# EAGLE design board2 (EAGLE 7.5.0)
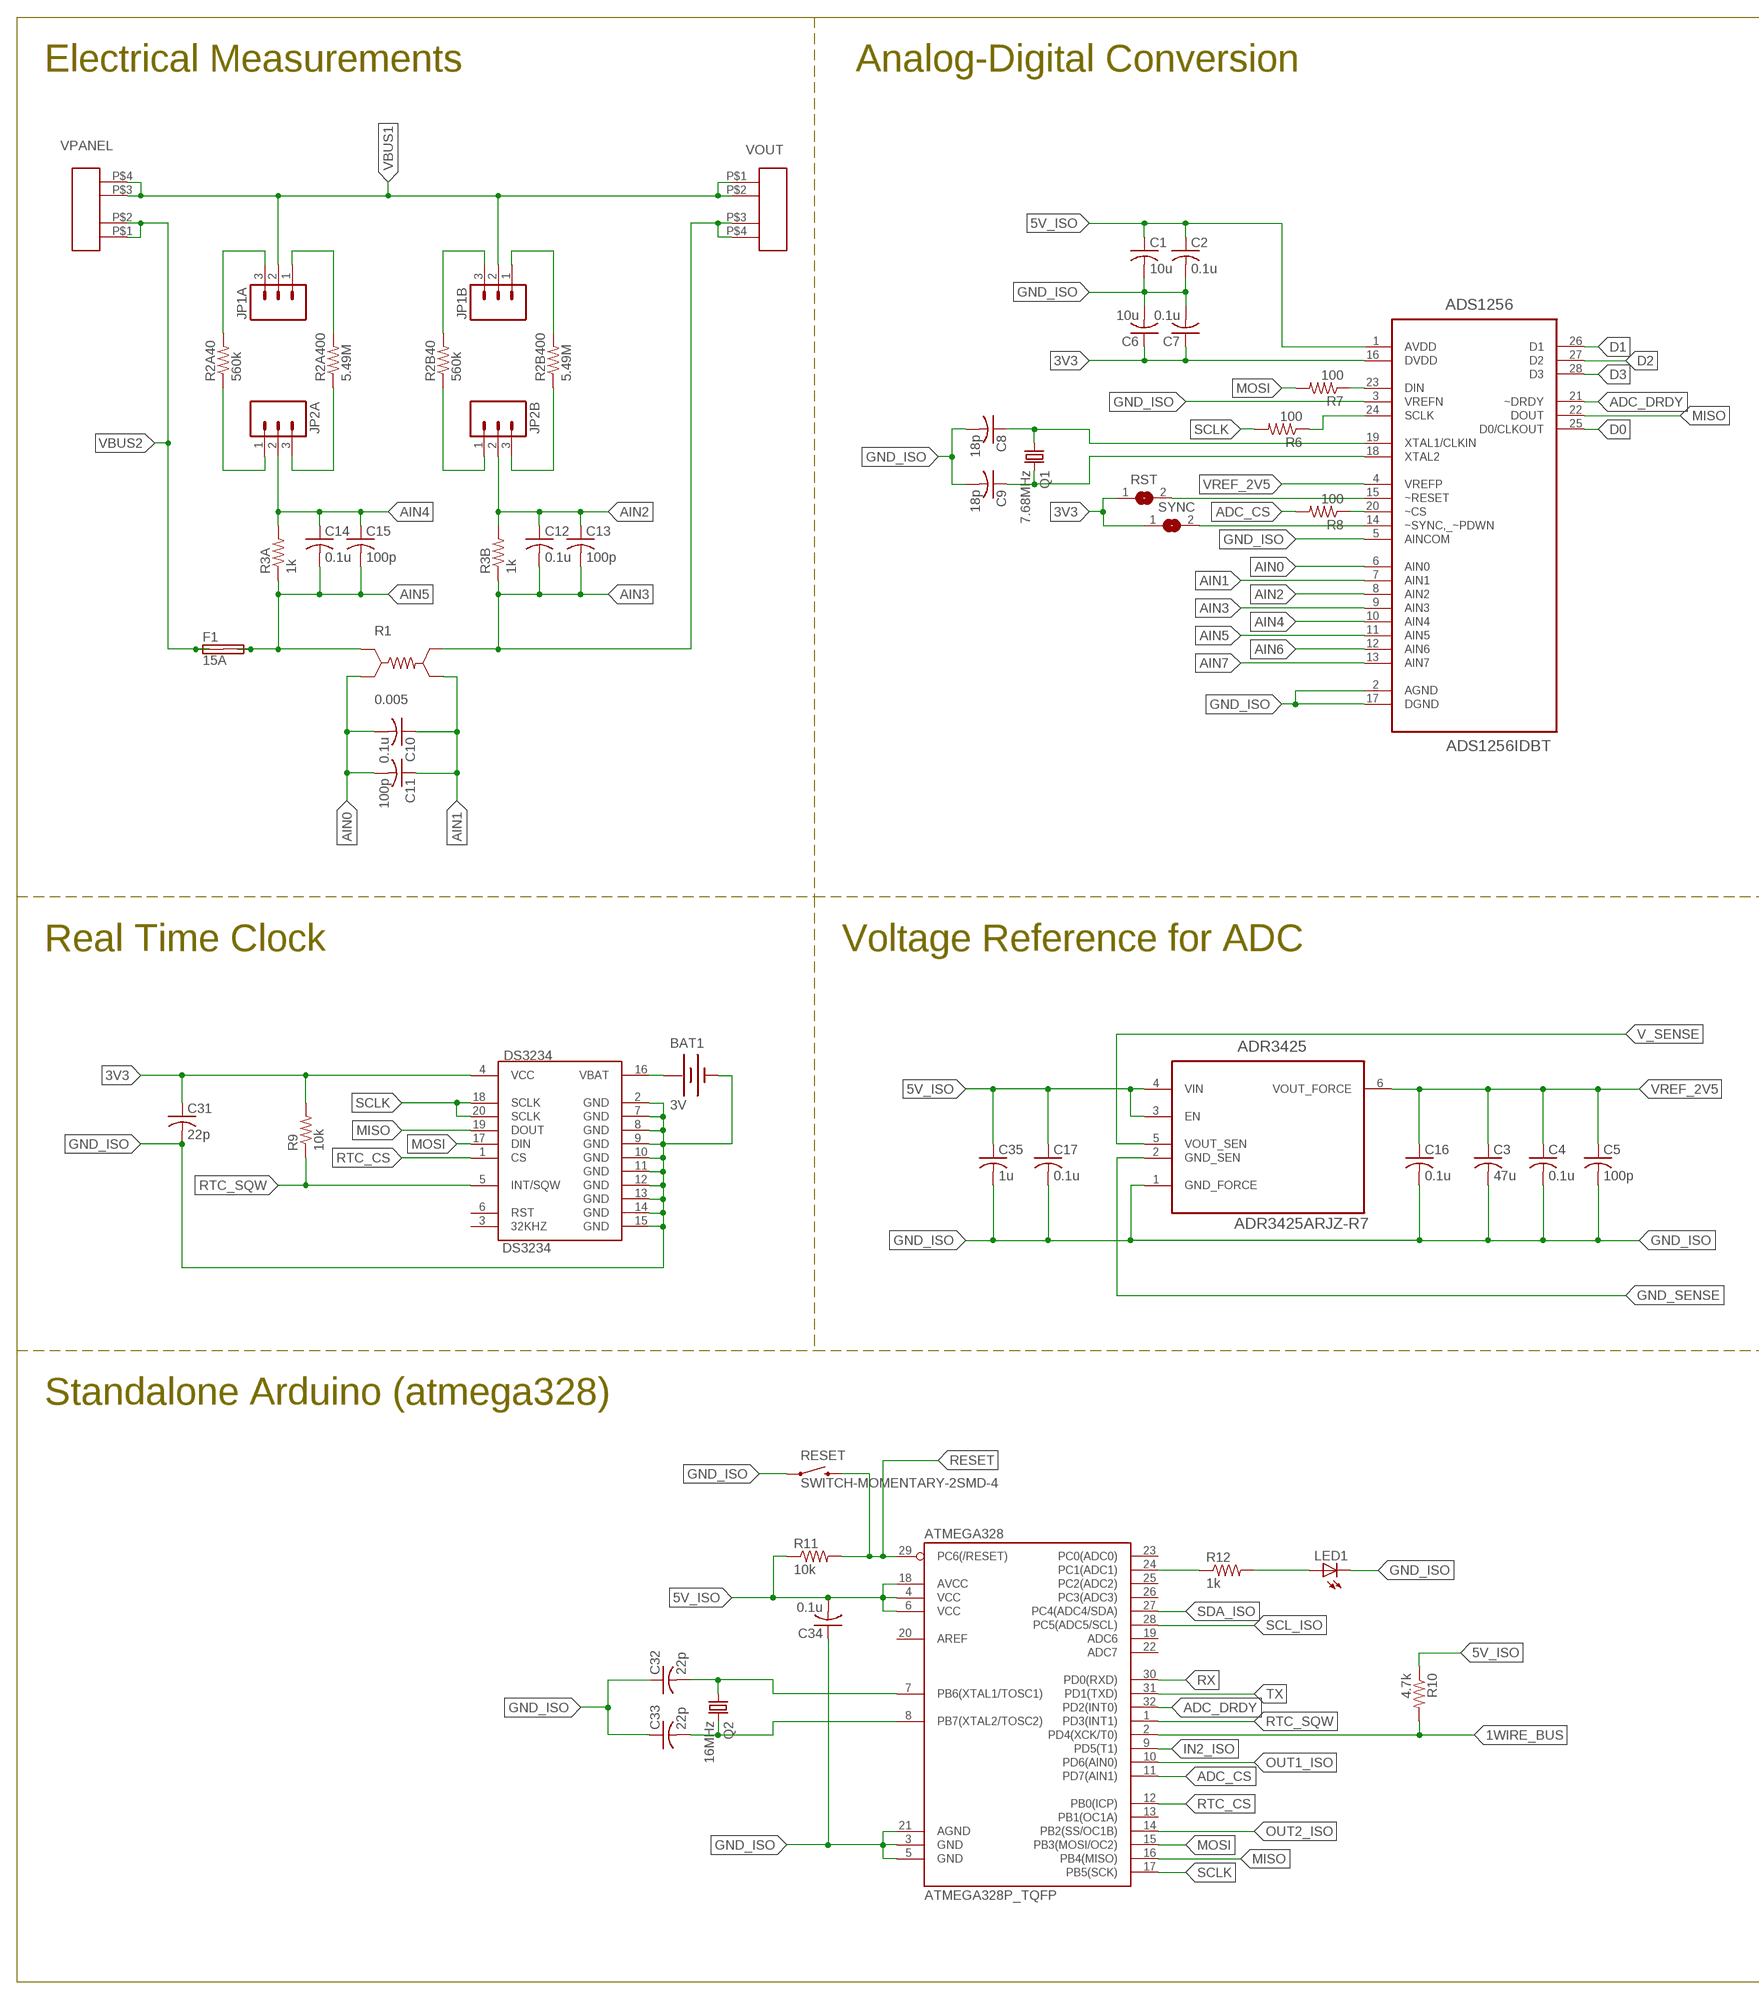
[diagram p0: schematic, sheet 1, part 1 of 2]
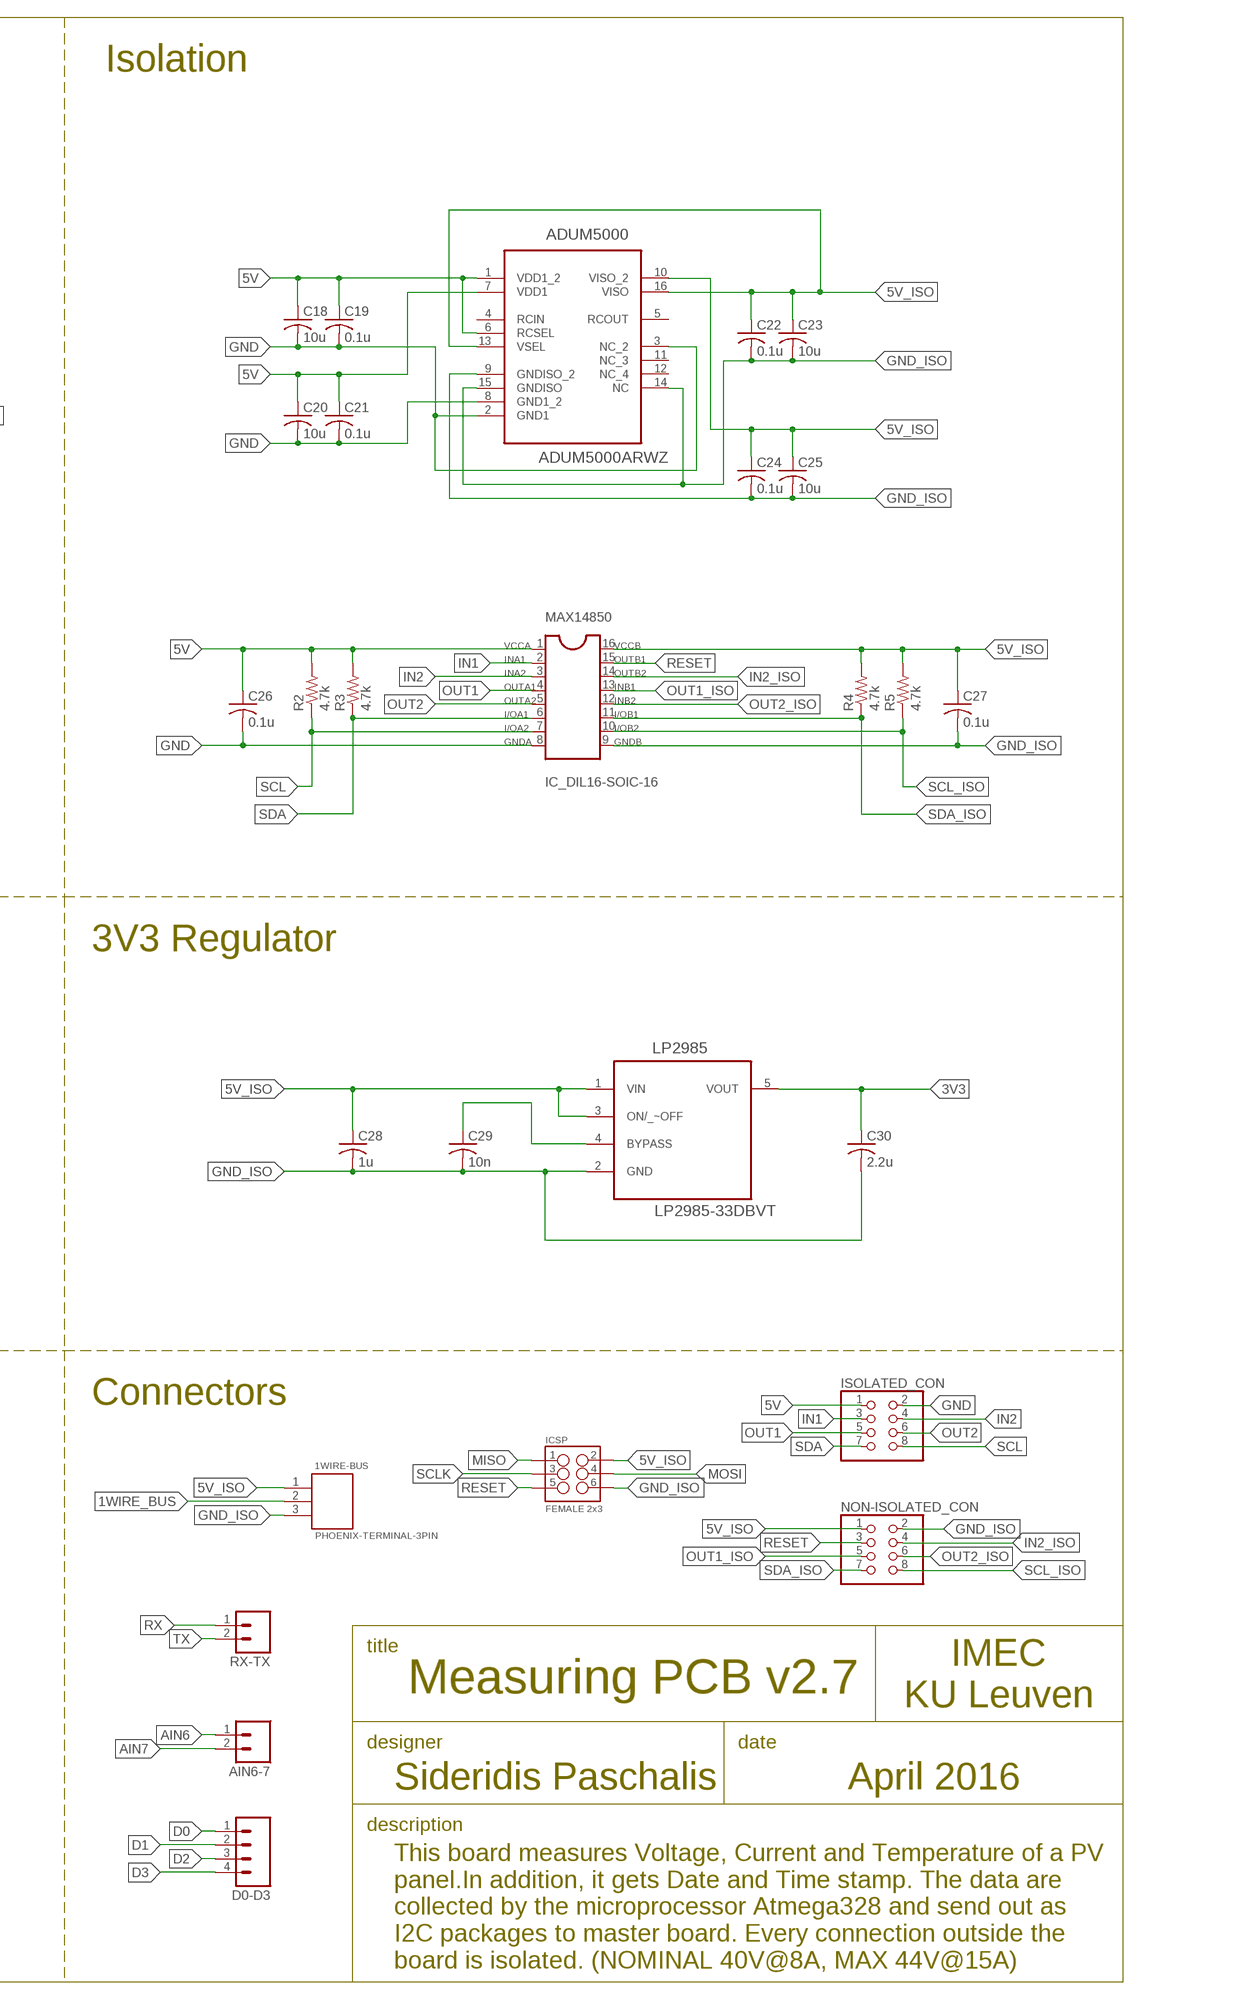
[diagram p1: schematic, sheet 1, part 2 of 2]

## Parts
1WIRE-BUS  PHOENIX-TERMINAL-3PIN  [PHOENIX-TERMINAL-3PIN]
ADR3425  ADR3425ARJZ-R7  [SOT95P280X145-6N]
ADS1256  ADS1256IDBT  [SOP65P780X200-28N]
ADUM5000  ADUM5000ARWZ  [SOIC127P1032X265-16N]
AIN6-7  M021X02_NO_SILK  [1X02_NO_SILK]
ATMEGA328  ATMEGA328P_TQFP  [TQFP32-08]
BAT1  3V  BATTERY12MM  [BATTCON_12MM]
C1  10u  C-USC3216  [C3216]
C2  0.1u  C-USC3216  [C3216]
C3  47u  C-USC3216  [C3216]
C4  0.1u  C-USC3216  [C3216]
C5  100p  C-USC3216  [C3216]
C6  10u  C-USC3216  [C3216]
C7  0.1u  C-USC3216  [C3216]
C8  18p  C-USC3216  [C3216]
C9  18p  C-USC3216  [C3216]
C10  0.1u  C-USC3216  [C3216]
C11  100p  C-USC3216  [C3216]
C12  0.1u  C-USC3216  [C3216]
C13  100p  C-USC3216  [C3216]
C14  0.1u  C-USC3216  [C3216]
C15  100p  C-USC3216  [C3216]
C16  0.1u  C-USC3216  [C3216]
C17  0.1u  C-USC3216  [C3216]
C18  10u  C-USC3216  [C3216]
C19  0.1u  C-USC3216  [C3216]
C20  10u  C-USC3216  [C3216]
C21  0.1u  C-USC3216  [C3216]
C22  0.1u  C-USC3216  [C3216]
C23  10u  C-USC3216  [C3216]
C24  0.1u  C-USC3216  [C3216]
C25  10u  C-USC3216  [C3216]
C26  0.1u  C-USC3216  [C3216]
C27  0.1u  C-USC3216  [C3216]
C28  1u  C-USC3216  [C3216]
C29  10n  C-USC3216  [C3216]
C30  2.2u  C-USC3216  [C3216]
C31  22p  C-USC3216  [C3216]
C32  22p  C-USC3216  [C3216]
C33  22p  C-USC3216  [C3216]
C34  0.1u  C-USC3216  [C3216]
C35  1u  C-USC3216  [C3216]
D0-D3  M04NO_SILK_ALL_ROUND  [1X04_NO_SILK_ALL_ROUND]
DS3234  DS3234  [DS3234]
F1  15A  SHK20L_PAS  [PAS_5X20]
ICSP  FEMALE 2x3  M03X2FEMALE  [2X3]
ISOLATED_CON  PINHD-2X4  [2X04]
JP1A  M03PTH  [1X03]
JP1B  M03PTH  [1X03]
JP2A  M03PTH  [1X03]
JP2B  M03PTH  [1X03]
LED1  LEDCHIPLED_0805  [CHIPLED_0805]
LP2985  LP2985-33DBVT  [SOT95P280X145-5N]
MAX14850  IC_DIL16-SOIC-16  [SOIC-16]
NON-ISOLATED_CON  PINHD-2X4  [2X04]
Q1  7.68MHz  CRYSTALHC49U-V  [HC49U-V]
Q2  16MHz  CRYSTALHC49U-V  [HC49U-V]
R1  0.005  LVK25R001  [LVK25]
R2  4.7k  R-US_R3216  [R3216]
R2A40  560k  R-US_M3216  [M3216]
R2A400  5.49M  R-US_M3216  [M3216]
R2B40  560k  R-US_M3216  [M3216]
R2B400  5.49M  R-US_M3216  [M3216]
R3  4.7k  R-US_R3216  [R3216]
R3A  1k  R-US_M3216  [M3216]
R3B  1k  R-US_M3216  [M3216]
R4  4.7k  R-US_R3216  [R3216]
R5  4.7k  R-US_R3216  [R3216]
R6  100  R-US_R3216  [R3216]
R7  100  R-US_R3216  [R3216]
R8  100  R-US_R3216  [R3216]
R9  10k  R-US_R3216  [R3216]
R10  4.7k  R-US_R3216  [R3216]
R11  10k  R-US_R3216  [R3216]
R12  1k  R-US_R3216  [R3216]
RESET  SWITCH-MOMENTARY-2SMD-4  [TACTILE_SWITCH_TALL]
RST  SJ  [SJ]
RX-TX  M02PTH  [1X02]
SYNC  SJ  [SJ]
VOUT  PAS-PHOENIXTERMINAL2PIN-10.16MM  [PAS-PHOENIXTERMINAL-2PIN-10.16MM]
VPANEL  PAS-PHOENIXTERMINAL2PIN-10.16MM  [PAS-PHOENIXTERMINAL-2PIN-10.16MM]

## Nets
1WIRE_BUS: 1WIRE-BUS.2 ATMEGA328.2(PD4(XCK/T0)) R10.2
3V3: ADS1256.16(DVDD) C6.1 C7.1 C30.1 C31.1 DS3234.4(VCC) LP2985.5(VOUT) R9.2 RST.1 SYNC.1
5V: ADUM5000.1(VDD1_2) ADUM5000.6(RCSEL) ADUM5000.7(VDD1) C18.1 C19.1 C20.1 C21.1 C26.1 ISOLATED_CON.1 MAX14850.1(VCCA) R2.2 R3.2
5V_ISO: 1WIRE-BUS.1 ADR3425.3(EN) ADR3425.4(VIN) ADS1256.1(AVDD) ADUM5000.10(VISO_2) ADUM5000.13(VSEL) ADUM5000.16(VISO) ATMEGA328.4(VCC) ATMEGA328.6(VCC) ATMEGA328.18(AVCC) C1.1 C2.1 C17.1 C22.1 C23.1 C24.1 C25.1 C27.1 C28.1 C34.2 C35.1 ICSP.2 LP2985.1(VIN) LP2985.3(ON/_~OFF) MAX14850.16(VCCB) NON-ISOLATED_CON.1 R4.2 R5.2 R10.1 R11.1
ADC_CS: ATMEGA328.11(PD7(AIN1)) R8.2
ADC_DRDY: ADS1256.21(~DRDY) ATMEGA328.32(PD2(INT0))
AIN0: ADS1256.6(AIN0) C10.2 C11.2 R1.INV
AIN1: ADS1256.7(AIN1) C10.1 C11.1 R1.OUTV
AIN2: ADS1256.8(AIN2) C12.1 C13.1 JP2B.2 R3B.2
AIN3: ADS1256.9(AIN3) C12.2 C13.2 R1.OUTI R3B.1 VOUT.P$3 VOUT.P$4
AIN4: ADS1256.10(AIN4) C14.1 C15.1 JP2A.2 R3A.2
AIN5: ADS1256.11(AIN5) C14.2 C15.2 F1.2A F1.2B R1.INI R3A.1
AIN6: ADS1256.12(AIN6) AIN6-7.1
AIN7: ADS1256.13(AIN7) AIN6-7.2
D0: ADS1256.25(D0/CLKOUT) D0-D3.1
D1: ADS1256.26(D1) D0-D3.2
D2: ADS1256.27(D2) D0-D3.3
D3: ADS1256.28(D3) D0-D3.4
GND: ADUM5000.2(GND1) ADUM5000.3(NC_2) ADUM5000.8(GND1_2) C18.2 C19.2 C20.2 C21.2 C26.2 ISOLATED_CON.2 MAX14850.8(GNDA)
GND_ISO: 1WIRE-BUS.3 ADR3425.1(GND_FORCE) ADS1256.2(AGND) ADS1256.3(VREFN) ADS1256.5(AINCOM) ADS1256.17(DGND) ADUM5000.9(GNDISO_2) ADUM5000.14(NC) ADUM5000.15(GNDISO) ATMEGA328.3(GND) ATMEGA328.5(GND) ATMEGA328.21(AGND) BAT1.GND(-) C1.2 C2.2 C3.2 C4.2 C5.2 C6.2 C7.2 C8.2 C9.2 C16.2 C17.2 C22.2 C23.2 C24.2 C25.2 C27.2 C28.2 C29.2 C30.2 C31.2 C32.1 C33.1 C34.1 C35.2 DS3234.2(GND) DS3234.7(GND) DS3234.8(GND) DS3234.9(GND) DS3234.10(GND) DS3234.11(GND) DS3234.12(GND) DS3234.13(GND) DS3234.14(GND) DS3234.15(GND) ICSP.6 LED1.C LP2985.2(GND) MAX14850.9(GNDB) NON-ISOLATED_CON.2 RESET.A2
GND_SENSE: ADR3425.2(GND_SEN)
IN1: ISOLATED_CON.3 MAX14850.2(INA1)
IN2: ISOLATED_CON.4 MAX14850.3(INA2)
IN2_ISO: ATMEGA328.9(PD5(T1)) MAX14850.14(OUTB2) NON-ISOLATED_CON.4
MISO: ADS1256.22(DOUT) ATMEGA328.16(PB4(MISO)) DS3234.19(DOUT) ICSP.1
MOSI: ATMEGA328.15(PB3(MOSI/OC2)) DS3234.17(DIN) ICSP.4 R7.2
N$1: ADS1256.24(SCLK) R6.1
N$2: JP1A.3 R2A40.2
N$3: JP1A.1 R2A400.2
N$4: JP2A.3 R2A400.1
N$5: JP2A.1 R2A40.1
N$6: ATMEGA328.8(PB7(XTAL2/TOSC2)) C33.2 Q2.2
N$7: JP1B.3 R2B40.2
N$8: JP1B.1 R2B400.2
N$9: JP2B.3 R2B400.1
N$10: JP2B.1 R2B40.1
N$11: ADS1256.19(XTAL1/CLKIN) C8.1 Q1.1
N$12: ADS1256.18(XTAL2) C9.1 Q1.2
N$13: ATMEGA328.7(PB6(XTAL1/TOSC1)) C32.2 Q2.1
N$14: ADS1256.23(DIN) R7.1
N$15: BAT1.PWR@1(+) DS3234.16(VBAT)
N$16: ADS1256.20(~CS) R8.1
N$17: ADS1256.15(~RESET) RST.2
N$18: ATMEGA328.24(PC1(ADC1)) R12.1
N$19: LED1.A R12.2
N$20: ADS1256.14(~SYNC,_~PDWN) SYNC.2
N$21: C29.1 LP2985.4(BYPASS)
OUT1: ISOLATED_CON.5 MAX14850.4(OUTA1)
OUT1_ISO: ATMEGA328.10(PD6(AIN0)) MAX14850.13(INB1) NON-ISOLATED_CON.5
OUT2: ISOLATED_CON.6 MAX14850.5(OUTA2)
OUT2_ISO: ATMEGA328.14(PB2(SS/OC1B)) MAX14850.12(INB2) NON-ISOLATED_CON.6
RESET: ATMEGA328.29(PC6(/RESET)) ICSP.5 MAX14850.15(OUTB1) NON-ISOLATED_CON.3 R11.2 RESET.B2
RTC_CS: ATMEGA328.12(PB0(ICP)) DS3234.1(CS)
RTC_SQW: ATMEGA328.1(PD3(INT1)) DS3234.5(INT/SQW) R9.1
RX: ATMEGA328.30(PD0(RXD)) RX-TX.1
SCL: ISOLATED_CON.8 MAX14850.7(I/OA2) R2.1
SCL_ISO: ATMEGA328.28(PC5(ADC5/SCL)) MAX14850.10(I/OB2) NON-ISOLATED_CON.8 R5.1
SCLK: ATMEGA328.17(PB5(SCK)) DS3234.18(SCLK) DS3234.20(SCLK) ICSP.3 R6.2
SDA: ISOLATED_CON.7 MAX14850.6(I/OA1) R3.1
SDA_ISO: ATMEGA328.27(PC4(ADC4/SDA)) MAX14850.11(I/OB1) NON-ISOLATED_CON.7 R4.1
TX: ATMEGA328.31(PD1(TXD)) RX-TX.2
V_SENSE: ADR3425.5(VOUT_SEN)
VBUS1: JP1A.2 JP1B.2 VOUT.P$1 VOUT.P$2 VPANEL.P$3 VPANEL.P$4
VBUS2: F1.1A F1.1B VPANEL.P$1 VPANEL.P$2
VREF_2V5: ADR3425.6(VOUT_FORCE) ADS1256.4(VREFP) C3.1 C4.1 C5.1 C16.1
Unconnected: ADUM5000.4(RCIN) ADUM5000.5(RCOUT) ADUM5000.11(NC_3) ADUM5000.12(NC_4) ATMEGA328.13(PB1(OC1A)) ATMEGA328.19(ADC6) ATMEGA328.20(AREF) ATMEGA328.22(ADC7) ATMEGA328.23(PC0(ADC0)) ATMEGA328.25(PC2(ADC2)) ATMEGA328.26(PC3(ADC3)) DS3234.3(32KHZ) DS3234.6(RST)

## Notes on the sheet
- Electrical Measurements | Analog-Digital Conversion | Isolation
- Real Time Clock | Voltage Reference for ADC | 3V3 Regulator
- Standalone Arduino (atmega328) | Connectors
- title
- Measuring PCB v2.7
- IMEC
  KU Leuven
- designer | date
- Sideridis Paschalis | April 2016
- description
- This board measures Voltage, Current and Temperature of a PV
  panel.In addition, it gets Date and Time stamp. The data are
  collected by the microprocessor Atmega328 and send out as
  I2C packages to master board. Every connection outside the
  board is isolated. (NOMINAL 40V@8A, MAX 44V@15A)

## Library data of the parts
1WIRE-BUS = Paschalis_connectors:PHOENIX-TERMINAL-3PIN
ADR3425 = Analog Devices_By_element14_Batch_1:ADR3425ARJZ-R7: Micropower, High Accuracy Voltage References; MPN: ADR3425ARJZ-R7; OC_FARNELL: 1827384; OC_NEWARK: 67R2201; PACKAGE: SOT-23-6; SUPPLIER: Analog Devices
ADS1256 = Texas Instruments_By_element14_Batch_1:ADS1256IDBT: ADC; MPN: ADS1256IDBT; OC_FARNELL: 1470337; OC_NEWARK: 73H4119; PACKAGE: SSOP-28; SUPPLIER: TEXAS INSTRUMENTS
ADUM5000 = Analog Devices_By_element14_Batch_1:ADUM5000ARWZ: 2.5 kV, Isolated DC-to-DC Converter; MPN: ADUM5000ARWZ; OC_FARNELL: 1701256; OC_NEWARK: 19P8235; PACKAGE: SOIC-16; SUPPLIER: Analog Devices
AIN6-7 RX-TX = SparkFun-Connectors:M02: Standard 2-pin 0.1" header. Use with - straight break away headers ( PRT-00116) - right angle break away headers (PRT-00553) - swiss pins (PRT-00743) - machine pins (PRT-00117) - female headers (PRT-00115) Molex polarized connector foot print use with: PRT-08233 with associated crimp pins and housings. 2.54_SCREWTERM for use with PRT-10571. 3.5mm Screw Terminal footprints for PRT-08084 5mm Screw Terminal footprints for use with PRT-08432
ATMEGA328 = SparkFun-DigitalIC:ATMEGA328P_TQFP; PROD_ID: IC-09069
BAT1 = SparkFun-Electromechanical:BATTERY: Battery Holders Various common sizes : AA, AAA, 18650 (PRT-12895), 20mm coin cell and 12mm coin cell. 20MM_4LEGS, BATT-10373; PROD_ID: BATT-08044
C1-C35 = adafruit:C-US: CAPACITOR, American symbol
D0-D3 = SparkFun-Connectors:M04: Header 4 Standard 4-pin 0.1" header. Use with straight break away headers (SKU : PRT-00116), right angle break away headers (PRT-00553), swiss pins (PRT-00743), machine pins (PRT-00117), and female headers (PRT-00115). Molex polarized connector foot print use with SKU : PRT-08231 with associated crimp pins and housings. 1MM SMD Version SKU: PRT-10208
DS3234 = SparkFun-FreqCtrl:DS3234: SPI RTC module with battery backup and internal clock.
F1 = fuse:SHK20L_PAS: FUSE HOLDER 5 x 20 mm, SH contact, SHH1 Schukat, E1073 Buerklin
ICSP = SparkFun-Connectors:M03X2: 2x3 .1" header. Shrouded, with keying- CONN-10681 SMT- CONN-11415 Pogo pins- HW-11044; PROD_ID: CONN-11566
ISOLATED_CON NON-ISOLATED_CON = adafruit:PINHD-2X4: PIN HEADER
JP1A JP1B JP2A JP2B = SparkFun-Connectors:M03: Header 3 Standard 3-pin 0.1" header. Use with straight break away headers (SKU : PRT-00116), right angle break away headers (PRT-00553), swiss pins (PRT-00743), machine pins (PRT-00117), and female headers (PRT-00115). Molex polarized connector foot print use with SKU : PRT-08232 with associated crimp pins and housings.
LED1 = adafruit:LED: LED OSRAM: - CHIPLED LG R971, LG N971, LY N971, LG Q971, LY Q971, LO R971, LY R971 LH N974, LH R974 LS Q976, LO Q976, LY Q976 LO Q996 - Hyper CHIPLED LW Q18S LB Q993, LB Q99A, LB R99A - SideLED LS A670, LO A670, LY A670, LG A670, LP A670 LB A673, LV A673, LT A673, LW A673 LH A674 LY A675 LS A676, LA A676, LO A676, LY A676, LW A676 LS A679, LY A679, LG A679 - Hyper Micro SIDELED® LS Y876, LA Y876, LO Y876, LY Y876 LT Y87S - SmartLED LW L88C, LW L88S LB L89C, LB L89S, LG L890 LS L89K, LO L89K, LY L89K LS L896, LA L896, LO L896, LY L896 - TOPLED LS T670, LO T670, LY T670, LG T670, LP T670 LSG T670, LSP T670, LSY T670, LOP T670, LYG T670 LG T671, LOG T671, LSG T671 LB T673, LV T673, LT T673, LW T673 LH T674 LS T676, LA T676, LO T676, LY T676, LB T676, LH T676, LSB T676, LW T676 LB T67C, LV T67C, LT T67C, LS T67K, LO T67K, LY T67K, LW E67C LS E67B, LA E67B, LO E67B, LY E67B, LB E67C, LV E67C, LT E67C LW T67C LS T679, LY T679, LG T679 LS T770, LO T770, LY T770, LG T770, LP T770 LB T773, LV T773, LT T773, LW T773 LH T774 LS E675, LA E675, LY E675, LS T675 LS T776, LA T776, LO T776, LY T776, LB T776 LHGB T686 LT T68C, LB T68C - Hyper Mini TOPLED® LB M676 - Mini TOPLED Santana® LG M470 LS M47K, LO M47K, LY M47K Source: http://www.osram.convergy.de/
LP2985 = Texas Instruments_By_element14_Batch_1:LP2985-33DBVT: 150-mA LOW-NOISE LOW-DROPOUT REGULATOR WITH SHUTDOWN; MPN: LP2985-33DBVT; OC_FARNELL: -; OC_NEWARK: 43J9347; PACKAGE: SOT-23-5; SUPPLIER: Texas Instruments
MAX14850 = MAX14850ASE:IC_DIL16
Q1 Q2 = adafruit:CRYSTAL: CRYSTAL; OC_FARNELL: 1666969; OC_NEWARK: unknown
R1 = LVK25:LVK25
R2 R2A40 R2A400 R2B40 R2B400 R3 R3A R3B R4-R12 = adafruit:R-US_: RESISTOR, American symbol
RESET = SparkFun-Electromechanical:SWITCH-MOMENTARY-2: Various NO switches- pushbuttons, reed, etc; PROD_ID: SWCH-11966
RST SYNC = jumper:SJ: SMD solder JUMPER
VOUT VPANEL = PAS-PHOENIXTERMINAL:PAS-PHOENIXTERMINAL2PIN-10.16MM

## Board
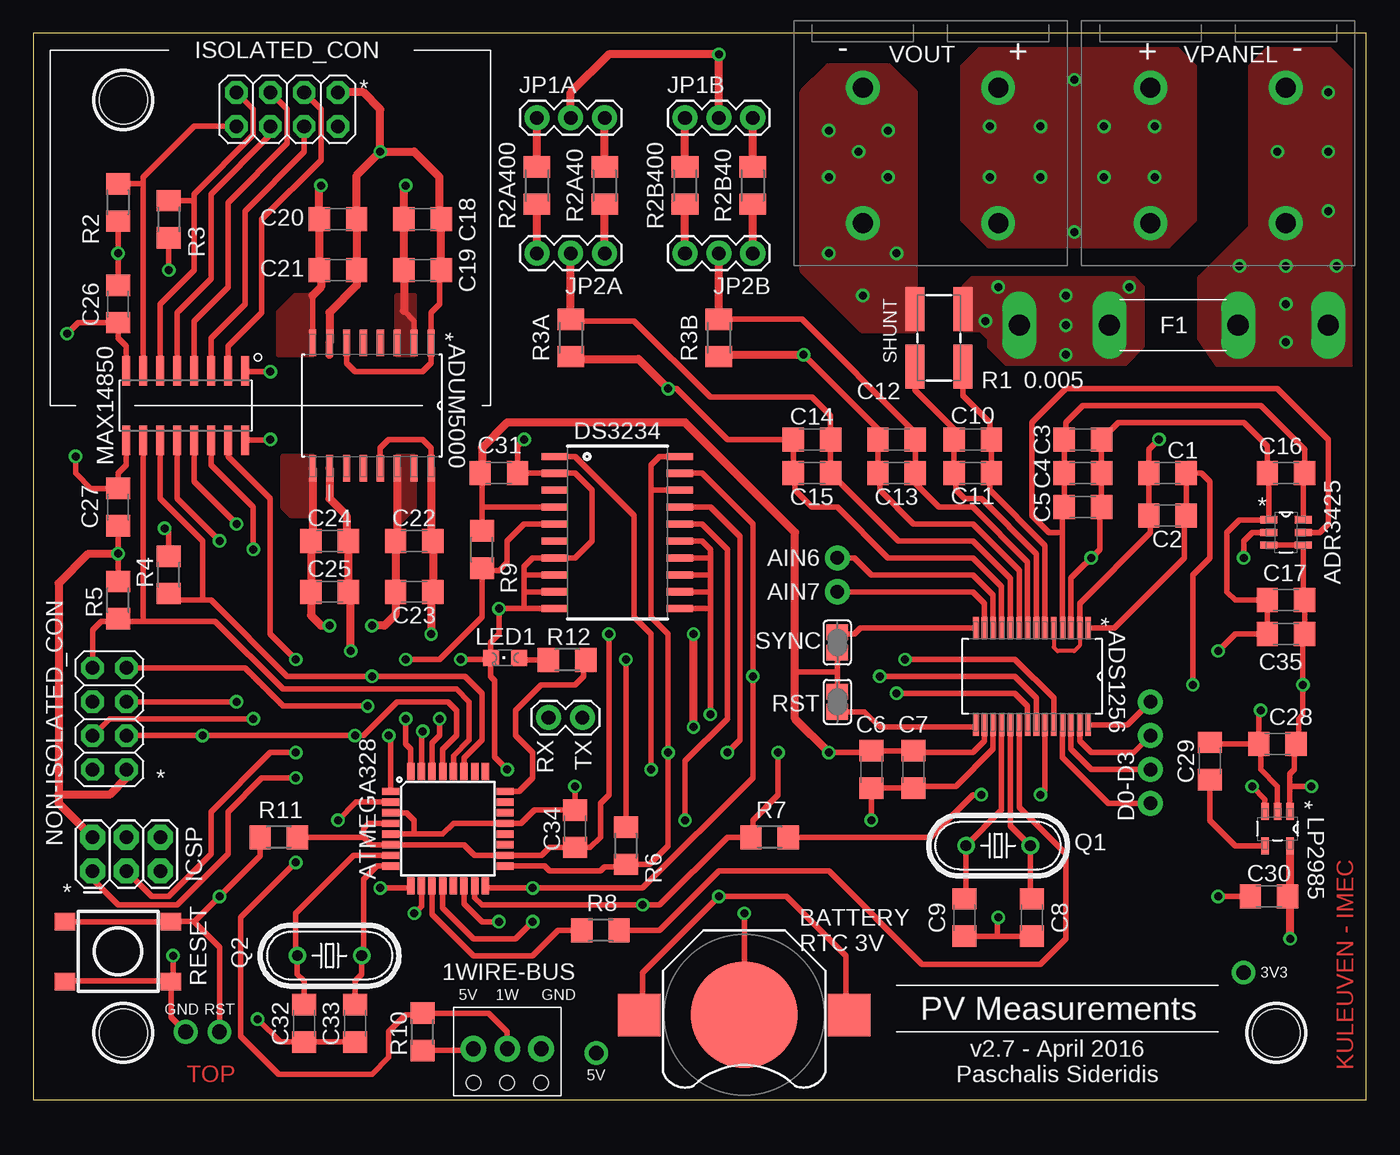
[diagram p2: board, top side]
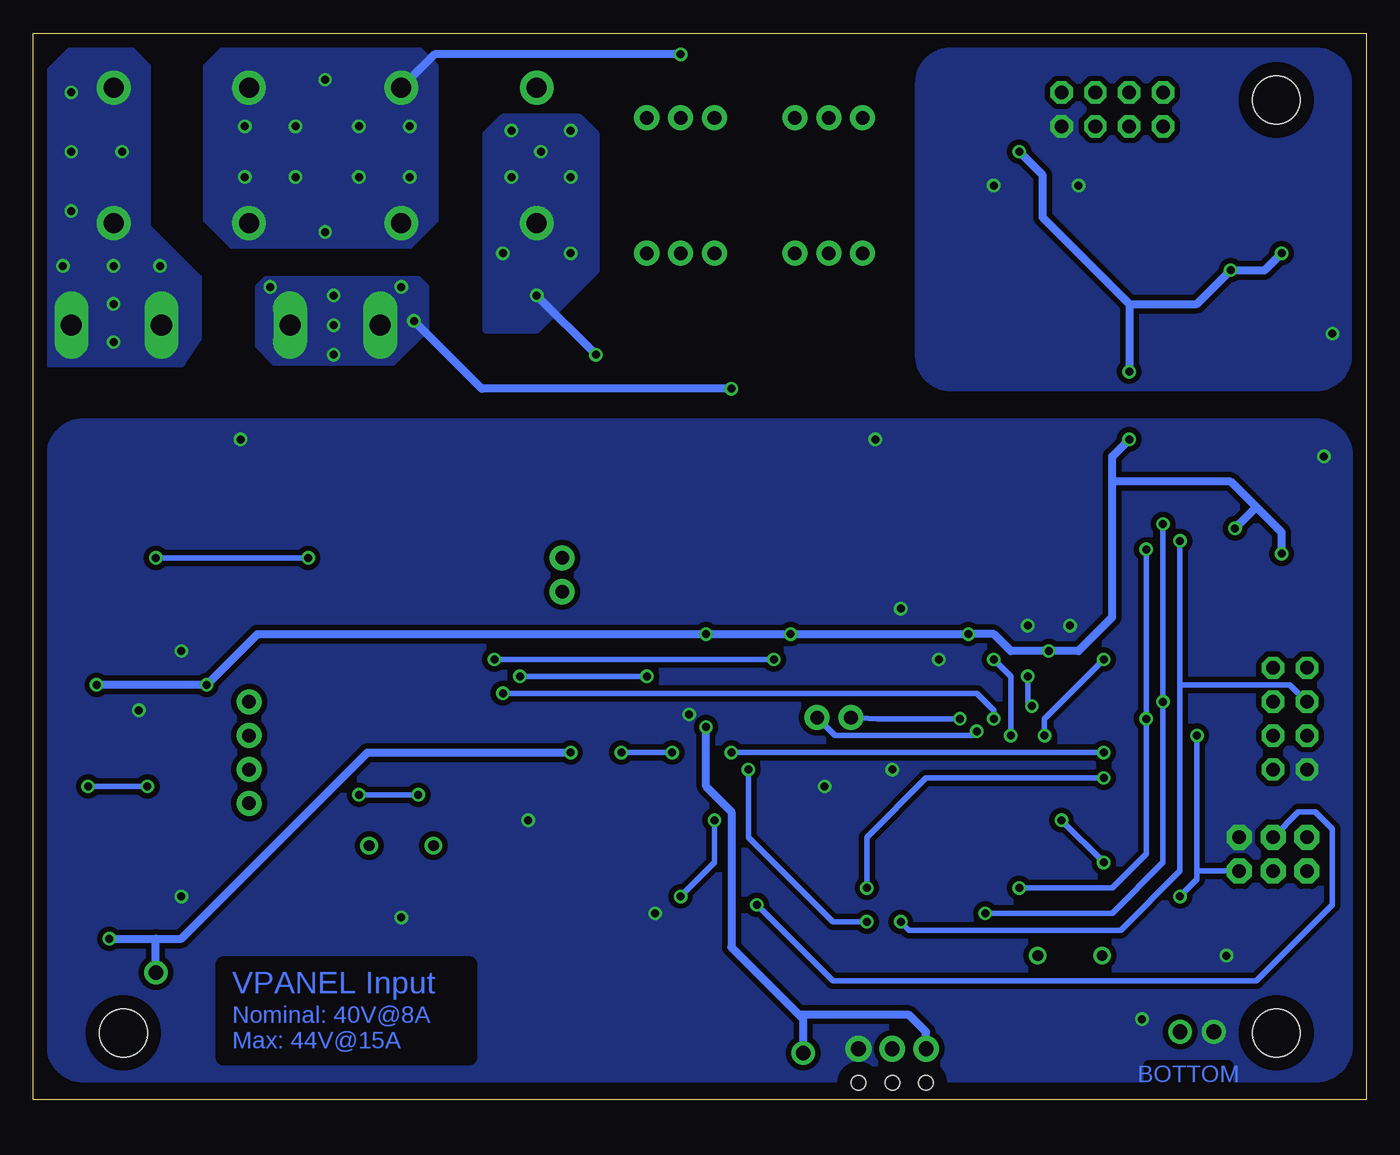
[diagram p3: board, bottom side, seen from below]

Size 100 x 80 mm. Coordinates in mm from the lower left corner, seen from the top.
Outline: 0,0 100,0 100,80 0,80 0,0
Copper layers (1*16): Top 0.035mm / dielectric 1.5mm / Bottom 0.035mm
Design rules "default": minimum track width 10mil, minimum drill 24mil, track to track 8mil, track to pad 8mil, pad to pad 8mil, via to via 8mil, smd to smd 8mil, copper to edge 40mil, drill to drill 8mil, minimum pad ring 10mil, minimum via ring 8mil, stop-mask expansion 4mil, vias tented up to drill 0mil, thermal gap 10mil
Holes 3.6 mm at 6.75,5 6.75,75 93.25,5
bRestrict: area 67.3,3.2 to 85.7,10.2

### Footprints (pad centres in the part's own frame; a part is rotated, then mirrored left to right if it is on the bottom)
PHOENIX-TERMINAL-3PIN = drill 1.1 pad 1.93: 1 -2.54,0; 2 0,0; 3 2.54,0 | hole 1.1: -2.54,-2.54; 0,-2.54; 2.54,-2.54
SOT95P280X145-6N = smd 1.27 x 0.559: 1 -1.295,0.94; 2 -1.295,0; 3 -1.295,-0.94; 4 1.295,-0.94; 5 1.295,0; 6 1.295,0.94
SOP65P780X200-28N = smd 1.651 x 0.432: 1 -3.632,4.216; 2 -3.632,3.581; 3 -3.632,2.921; 4 -3.632,2.286; 5 -3.632,1.626; 6 -3.632,0.965; 7 -3.632,0.33; 8 -3.632,-0.33; 9 -3.632,-0.965; 10 -3.632,-1.626; 11 -3.632,-2.286; 12 -3.632,-2.921; 13 -3.632,-3.581; 14 -3.632,-4.216; 15 3.632,-4.216; 16 3.632,-3.581; 17 3.632,-2.921; 18 3.632,-2.286; 19 3.632,-1.626; 20 3.632,-0.965; 21 3.632,-0.33; 22 3.632,0.33; 23 3.632,0.965; 24 3.632,1.626; 25 3.632,2.286; 26 3.632,2.921; 27 3.632,3.581; 28 3.632,4.216
SOIC127P1032X265-16N = smd 1.981 x 0.533: 1 -4.699,4.445; 2 -4.699,3.175; 3 -4.699,1.905; 4 -4.699,0.635; 5 -4.699,-0.635; 6 -4.699,-1.905; 7 -4.699,-3.175; 8 -4.699,-4.445; 9 4.699,-4.445; 10 4.699,-3.175; 11 4.699,-1.905; 12 4.699,-0.635; 13 4.699,0.635; 14 4.699,1.905; 15 4.699,3.175; 16 4.699,4.445
1X02_NO_SILK = drill 1.016 pad 1.88: 1 0,0; 2 2.54,0
TQFP32-08 = smd 1.27 x 0.559: 1 -4.293,2.8; 2 -4.293,2; 3 -4.293,1.2; 4 -4.293,0.4; 5 -4.293,-0.4; 6 -4.293,-1.2; 7 -4.293,-2; 8 -4.293,-2.8; 17 4.293,-2.8; 18 4.293,-2; 19 4.293,-1.2; 20 4.293,-0.4; 21 4.293,0.4; 22 4.293,1.2; 23 4.293,2; 24 4.293,2.8 | smd 0.559 x 1.27: 9 -2.8,-4.293; 10 -2,-4.293; 11 -1.2,-4.293; 12 -0.4,-4.293; 13 0.4,-4.293; 14 1.2,-4.293; 15 2,-4.293; 16 2.8,-4.293; 25 2.8,4.293; 26 2,4.293; 27 1.2,4.293; 28 0.4,4.293; 29 -0.4,4.293; 30 -1.2,4.293; 31 -2,4.293; 32 -2.8,4.293
BATTCON_12MM = smd 8 x 8: GND 0,0 | smd 3.175 x 3.175: PWR@1 -7.874,0; PWR@2 7.874,0
C3216 = smd 1.6 x 1.8: 1 -1.4,0; 2 1.4,0
1X04_NO_SILK_ALL_ROUND = drill 1.016 pad 1.88: 1 0,0; 2 2.54,0; 3 5.08,0; 4 7.62,0
DS3234 = smd 0.53 x 1.98: 1 -5.715,-4.685; 2 -4.445,-4.685; 3 -3.175,-4.685; 4 -1.905,-4.685; 5 -0.635,-4.685; 6 0.635,-4.685; 7 1.905,-4.685; 8 3.175,-4.685; 9 4.445,-4.685; 10 5.715,-4.685; 11 5.715,4.685; 12 4.445,4.685; 13 3.175,4.685; 14 1.905,4.685; 15 0.635,4.685; 16 -0.635,4.685; 17 -1.905,4.685; 18 -3.175,4.685; 19 -4.445,4.685; 20 -5.715,4.685
PAS_5X20 = drill 1.6 pad 2.54 long: 1A -23.144,0; 1B -16.384,0; 2A 0.034,0; 2B -6.726,0
2X3 = drill 1.016 pad 1.88 octagon: 1 0,0; 2 0,2.54; 3 2.54,0; 4 2.54,2.54; 5 5.08,0; 6 5.08,2.54
2X04 = drill 1.016 pad 1.676 octagon: 1 -3.81,-1.27; 2 -3.81,1.27; 3 -1.27,-1.27; 4 -1.27,1.27; 5 1.27,-1.27; 6 1.27,1.27; 7 3.81,-1.27; 8 3.81,1.27
1X03 = drill 1.016 pad 1.88: 1 0,0; 2 2.54,0; 3 5.08,0
CHIPLED_0805 = smd 1.2 x 1.2: A 0,-1.05; C 0,1.05
SOT95P280X145-5N = smd 1.27 x 0.559: 1 -1.295,0.94; 2 -1.295,0; 3 -1.295,-0.94; 4 1.295,-0.94; 5 1.295,0.94
SOIC-16 = smd 0.6 x 2.2: 1 -4.445,-2.6; 2 -3.175,-2.6; 3 -1.905,-2.6; 4 -0.635,-2.6; 5 0.635,-2.6; 6 1.905,-2.6; 7 3.175,-2.6; 8 4.445,-2.6; 9 4.445,2.6; 10 3.175,2.6; 11 1.905,2.6; 12 0.635,2.6; 13 -0.635,2.6; 14 -1.905,2.6; 15 -3.175,2.6; 16 -4.445,2.6
HC49U-V = drill 0.813: 1 -2.413,0; 2 2.413,0
LVK25 = smd 1.4 x 3.3: INI -1.8,-2.15; INV -1.8,2.15; OUTI 1.8,-2.15; OUTV 1.8,2.15
R3216 = smd 1.6 x 1.8: 1 -1.4,0; 2 1.4,0
M3216 = smd 1.6 x 2: 1 -1.4,0; 2 1.4,0
TACTILE_SWITCH_TALL = smd 1.55 x 1.3: A1 -3.975,-2.25; A2 3.975,-2.25; B1 -3.975,2.25; B2 3.975,2.25
SJ = smd 1.168 x 1.6: 1 -0.762,0; 2 0.762,0
1X02 = drill 1.016 pad 1.88: 1 0,0; 2 2.54,0
PAS-PHOENIXTERMINAL-2PIN-10.16MM = drill 1.5 pad 2.54: P$1 -5.08,-4.16; P$2 -5.08,6; P$3 5.08,-4.16; P$4 5.08,6

### Placement (x,y rotation side)
1WIRE-BUS  35.56,3.81 0 top
ADR3425  93.98,42.55 0 top
ADS1256  74.93,31.75 270 top
ADUM5000  25.4,52.07 270 top
AIN6-7  60.33,40.64 270 top
ATMEGA328  31.11,20.32 0 top
BAT1  53.34,6.35 180 top
C1  85.09,46.99 180 top
C2  85.09,43.81 180 top
C3  78.74,49.53 0 top
C4  78.74,46.99 0 top
C5  78.74,44.45 0 top
C6  62.87,24.77 270 top
C7  66.04,24.77 270 top
C8  74.93,13.65 270 top
C9  69.85,13.65 270 top
C10  70.48,49.53 0 top
C11  70.48,46.99 0 top
C12  64.77,49.53 180 top
C13  64.77,46.99 180 top
C14  58.42,49.53 180 top
C15  58.42,46.99 180 top
C16  93.98,46.99 180 top
C17  93.98,37.47 180 top
C18  29.21,66.04 180 top
C19  29.21,62.23 180 top
C20  22.86,66.04 180 top
C21  22.86,62.23 180 top
C22  28.57,41.91 180 top
C23  28.57,38.1 180 top
C24  22.23,41.91 180 top
C25  22.23,38.1 180 top
C26  6.35,59.69 270 top
C27  6.35,44.45 90 top
C28  93.34,26.67 180 top
C29  88.27,25.4 90 top
C30  92.71,15.24 180 top
C31  34.92,46.99 0 top
C32  20.32,5.71 90 top
C33  24.13,5.71 90 top
C34  40.64,20.32 270 top
C35  93.98,34.92 180 top
D0-D3  83.82,22.23 90 top
DS3234  43.81,42.55 270 top
F1  74.01,58.1 180 top
ICSP  4.45,17.14 0 top
ISOLATED_CON  19.05,74.3 180 top
JP1A  37.78,73.66 0 top
JP1B  48.9,73.66 0 top
JP2A  42.86,63.5 180 top
JP2B  53.98,63.5 180 top
LED1  35.41,33.15 90 top
LP2985  93.34,20.32 270 top
MAX14850  11.43,52.07 180 top
NON-ISOLATED_CON  5.71,28.57 90 top
Q1  72.39,19.05 180 top
Q2  22.23,10.79 0 top
R1  67.94,57.15 180 top
R2  6.35,67.31 270 top
R2A40  42.86,68.58 90 top
R2A400  37.78,68.58 90 top
R2B40  53.98,68.58 90 top
R2B400  48.9,68.58 90 top
R3  10.16,66.04 270 top
R3A  40.32,57.15 90 top
R3B  51.44,57.15 90 top
R4  10.16,39.37 90 top
R5  6.35,37.47 90 top
R6  44.45,19.05 270 top
R7  55.24,19.68 180 top
R8  42.55,12.7 180 top
R9  33.66,41.27 90 top
R10  29.21,5.08 90 top
R11  18.41,19.68 180 top
R12  40.05,33 180 top
RESET  6.35,11.11 0 top
RST  60.33,29.84 270 top
RX-TX  38.66,28.66 0 top
SYNC  60.33,34.29 90 top
VOUT  67.31,71.75 180 top
VPANEL  88.9,71.75 180 top

### Tracks (layer width: path | path; a pad name or v marks a point on that pad's centre or on a via)
1WIRE_BUS  (via drill 0.6)
  Top 0.406: v22.86,20.95 24.23,22.32 ATMEGA328.2 | 1WIRE-BUS.2 35.56,5.08 34.16,6.48 R10.2 29.08,6.35 27.94,6.35 26.67,5.08 26.67,3.17 25.4,1.91 18.41,1.91 15.56,4.76 15.56,13.65 v19.68,17.78
  Bottom 0.406: v19.68,17.78 v22.86,20.95
3V3  (via drill 0.6, 1.1 pad 1.78)
  Top 0.406: 93.98,15.37 C30.1 | ADS1256.16 71.35,26.9 70.48,26.04 66.17,26.04 C7.1 C6.1 62.73,26.04 v59.69,26.04 | R9.2 33.66,44.45 | 33.66,44.45 33.66,46.86 C31.1 | DS3234.4 33.66,44.45 | SYNC.1 60.33,32.07 | 60.33,32.07 RST.1 | 60.33,32.07 57.15,32.07
  Top 0.61: v59.69,26.04 57.15,28.57 57.15,32.07 57.15,42.55 48.9,50.8 35.56,50.8 33.66,48.9 33.66,47.12 C31.1 | v94.3,12.06 94.3,15.05 C30.1 94.28,15.41 LP2985.5
  Bottom 0.61: v94.3,12.06 90.81,12.06 | 90.81,12.06 88.9,12.06 74.93,26.04 v59.69,26.04 | v90.81,9.53 90.81,12.06
5V  (via drill 0.6)
  Top 0.406: 30.48,66.17 C18.1 | 24.13,62.1 C21.1 | C26.1 v6.35,63.5 R2.2 | MAX14850.1 15.94,54.61 v17.78,54.61 | R3.2 v10.16,62.23 | ADUM5000.6 23.5,55.24 24.13,54.61 29.21,54.61 29.84,55.24 ADUM5000.1 29.84,59.05 30.48,59.69 30.48,62.1 C19.1
  Top 0.61: 30.48,66.17 30.48,69.22 28.57,71.12 v26.04,71.12 | 24.13,66.17 C20.1 | C19.1 C18.1 | C20.1 C21.1 24.26,61.09 22.23,59.05 ADUM5000.7 22.23,55.88 | C20.1 24.26,69.34 v26.04,71.12 | v26.04,71.12 26.04,74.3 24.77,75.56 ISOLATED_CON.1
  Bottom 0.61: 17.78,59.69 24.26,66.17 24.26,69.34 v26.04,71.12 | 17.78,59.69 v17.78,54.61 | 17.78,59.69 12.7,59.69 v10.16,62.23 7.62,62.23 v6.35,63.5
5V_ISO  (via drill 0.6, 1.1 pad 1.78)
  Top 0.406: ADUM5000.13 26.04,48.9 26.67,49.53 29.21,49.53 29.84,48.9 ADUM5000.16 | R5.2 v6.35,40.96 C27.1 | ADR3425.3 ADR3425.4 95.28,37.57 C17.1 C35.1 95.25,34.8 v95.25,31.11 95.25,28.89 94.93,28.57 94.93,26.86 C28.1 94.61,26.54 94.61,24.77 94.28,24.43 94.28,23.5 | v87,31.11 87,39.37 88.27,40.64 88.27,46.35 87.63,46.99 C1.1 C2.1 86.36,43.69 86.36,40.64 81.1,35.38 ADS1256.1 | LP2985.1 94.28,23.5 | LP2985.3 92.41,22.53 v91.44,23.5 | v95.89,23.5 94.28,23.5 | 24.77,19.68 25.33,19.12 ATMEGA328.6 32.31,19.12 33.12,18.32 ATMEGA328.18 38.13,18.32 38.73,18.92 C34.2 41.78,18.92 42.55,19.68 42.55,22.23 43.18,22.86 v43.18,34.92 | ATMEGA328.4 25.16,20.72 24.77,20.32 24.77,19.68 | MAX14850.16 17.72,49.47 v17.78,49.53 | R4.2 10.16,42.55 v9.84,42.86 | R10.1 32.89,3.68 1WIRE-BUS.1 | R11.1 24.77,19.68
  Top 0.61: ADUM5000.16 29.84,42.04 C22.1 C23.1 29.84,38.1 v29.84,34.92 | ADUM5000.10 22.23,45.09 23.5,43.81 23.5,42.04 C24.1 C25.1 23.81,37.91 v23.81,33.66 | v49.53,27.94 v49.53,34.92 | v6.35,40.96 4.13,40.96 1.91,38.73 1.91,22.86 | 1.91,22.86 1.91,22.23 ICSP.2 | NON-ISOLATED_CON.1 6.99,24.13 5.71,22.86 1.91,22.86
  Bottom 0.406: v91.44,23.5 v95.89,23.5
  Bottom 0.61: v95.25,31.11 v87,31.11 83.19,34.92 v49.53,34.92 v43.18,34.92 v29.84,34.92 27.94,34.92 26.67,33.66 v23.81,33.66 21.59,33.66 19.05,36.2 19.05,46.35 | 19.05,46.35 19.05,48.26 v17.78,49.53 | v6.35,40.96 6.35,42.55 8.26,44.45 | 8.26,44.45 10.16,46.35 19.05,46.35 | v9.84,42.86 8.26,44.45 | 1WIRE-BUS.1 33.02,5.08 34.29,6.35 42.55,6.35 | v49.53,27.94 49.53,23.5 47.62,21.59 47.62,11.43 42.55,6.35 | v42.23,3.49 42.23,6.03 42.55,6.35
ADC_CS
  Top 0.406: ATMEGA328.11 29.91,13.9 33.02,10.79 37.47,10.79 39.37,12.7 R8.2
ADC_DRDY  (via drill 0.6)
  Top 0.406: v64.77,30.48 73.66,30.48 74.6,29.54 ADS1256.21 | ATMEGA328.32 28.32,26.3 27.94,26.67 v27.94,28.57
  Bottom 0.406: v64.77,30.48 29.21,30.48 27.94,29.21 v27.94,28.57
AIN0
  Top 0.406: R1.INV 69.75,52.81 71.75,50.8 71.75,49.66 C10.2 C11.2 71.75,46.86 71.75,45.72 75.89,41.58 ADS1256.6
AIN1
  Top 0.406: R1.OUTV 66.14,53.23 69.22,50.16 69.22,49.66 C10.1 C11.1 69.22,46.86 69.22,45.72 69.85,45.09 71.12,45.09 75.26,40.95 ADS1256.7
AIN2
  Top 0.406: ADS1256.8 74.6,40.34 70.48,44.45 67.94,44.45 66.04,46.35 66.04,46.86 C13.1 C12.1 66.04,49.66 66.04,50.16 57.66,58.55 R3B.2
  Top 0.61: R3B.2 JP2B.2
AIN3  (via drill 0.6)
  Top 0.406: ADS1256.9 73.97,39.7 70.48,43.18 66.04,43.18 63.5,45.72 63.5,46.86 C13.2 C12.2 63.37,50.3 v57.78,55.88 | 51.94,55.24 R3B.1
  Top 0.61: 51.94,55.24 51.94,55.38 51.44,55.88 | R3B.1 51.56,55.88 v57.78,55.88
  Bottom 0.61: v57.78,55.88 v62.23,60.33
  other vias: 59.69,72.71 64.14,72.71 59.69,69.22 64.14,69.22 59.69,63.5 64.77,63.5 61.91,71.12
  pour Top (no thermals): 59.69,77.47 64.14,77.47 66.04,75.56 66.04,57.78 62.23,57.78 57.78,62.23 57.78,75.56
  pour Bottom (no thermals): 66.04,57.78 62.23,57.78 57.78,62.23 57.78,72.39 59.05,73.66 64.77,73.66 66.04,72.39
AIN4
  Top 0.406: ADS1256.10 73.3,39.09 70.48,41.91 64.9,41.91 C15.1 C14.1 59.82,51.3 58.42,52.7 50.8,52.7 45.09,58.42 40.45,58.42 R3A.2
  Top 0.61: R3A.2 JP2A.2
AIN5  (via drill 0.6)
  Top 0.406: ADS1256.11 72.64,38.48 70.48,40.64 64.14,40.64 60.33,44.45 58.42,44.45 57.15,45.72 57.15,46.86 C15.2 C14.2 52.07,49.53 48.26,53.34 v47.62,53.34
  Top 0.61: R3A.1 40.51,55.56 45.4,55.56 v47.62,53.34
  Bottom 0.61: v47.62,53.34 66.36,53.34 v71.44,58.42
  other vias: 72.39,60.96 77.47,60.33 77.47,55.88 82.23,60.96 77.47,58.1
  pour Top (no thermals): 70.48,61.59 82.55,61.59 83.19,60.96 83.19,56.52 81.92,55.24 73.03,55.24 71.75,56.52 71.75,57.15 71.12,57.78 69.85,57.78 69.85,60.96
  pour Bottom (no thermals): 70.48,57.78 70.48,60.96 71.12,61.59 82.55,61.59 83.19,60.96 83.19,56.52 81.92,55.24 73.03,55.24
AIN6
  Top 0.406: ADS1256.12 72.01,37.85 70.48,39.37 62.87,39.37 61.59,40.64 AIN6-7.1
AIN7
  Top 0.406: ADS1256.13 71.35,37.24 70.48,38.1 AIN6-7.2
D0
  Top 0.406: ADS1256.25 77.22,25.65 80.64,22.23 D0-D3.1
D1
  Top 0.406: ADS1256.26 77.85,26.29 79.38,24.77 D0-D3.2
D2
  Top 0.406: ADS1256.27 78.51,26.9 79.38,26.04 82.55,26.04 D0-D3.3
D3
  Top 0.406: ADS1256.28 82.09,28.12 D0-D3.4
GND  (via drill 0.6)
  Top 0.406: 27.81,59.19 28.57,58.42 ADUM5000.2 | 20.95,60.33 ADUM5000.8 | MAX14850.8 6.99,56.52 6.35,57.15 C26.2 3.36,58.29 v2.54,57.47 | 21.59,62.1 C21.2
  Top 0.61: v27.94,68.58 27.81,68.45 C18.2 C19.2 27.81,59.19 | 21.59,62.1 21.59,60.96 20.95,60.33 | C21.2 C20.2 21.46,68.45 v21.59,68.58
  pour Bottom (isolate 0.406, no thermals): 33.66,55.84 33.66,76.24 arc90 31.16,78.74 3.77,78.74 arc90 1.27,76.24 1.27,55.84 arc90 3.77,53.34 31.16,53.34 arc90
  pour Top (no thermals): 28.57,55.88 28.57,60.33 27.3,60.33 27.3,55.88
  pour Top (no thermals): 20.95,55.88 18.41,55.88 18.41,59.05 19.68,60.33 20.95,60.33
GND_ISO  (via drill 0.6, 1.1 pad 1.78)
  Top 0.305: ADS1256.5 76.56,33.93 76.83,33.66 78.11,33.66 78.51,34.06 ADS1256.2
  Top 0.406: MAX14850.9 6.99,47.62 6.35,46.99 C27.2 4.32,45.85 3.17,46.99 v3.17,48.26 | ADS1256.2 78.51,37.24 83.82,42.55 83.82,43.69 C2.2 C1.2 83.69,48.77 v84.45,49.53 | LP2985.2 93.34,23.5 92.08,24.77 92.08,26.54 C28.2 | C28.2 88.39,26.67 C29.2 | C28.2 91.94,29.08 v92.08,29.21 | C30.2 v88.9,15.24 | ADS1256.17 72.01,26.29 69.22,23.5 66.17,23.5 C7.2 63.63,23.36 63.5,23.5 62.99,23.5 C6.2 v62.87,20.95 | C9.2 72.34,12.25 | 72.34,12.25 C8.2 | ATMEGA328.5 28.57,19.92 | 28.57,19.92 30.71,19.92 31.52,20.72 ATMEGA328.21 36.59,20.72 37.59,21.72 C34.1 v40.64,23.5 | ATMEGA328.3 28.01,21.52 28.57,20.95 28.57,19.92 | 37.47,36.83 DS3234.10 36.83,36.83 | 36.83,38.1 36.83,39.37 | 36.83,39.37 36.83,40.01 37.47,40.64 DS3234.7 40.64,40.64 41.91,41.91 41.91,45.72 40.64,46.99 DS3234.2 C31.2 36.33,49.02 v36.83,49.53 | DS3234.8 36.83,39.37 | DS3234.9 36.83,38.1 | DS3234.11 50.8,36.83 | 50.8,38.1 50.8,39.37 | 50.8,39.37 50.8,40.64 | 50.8,40.64 50.8,41.27 50.16,41.91 DS3234.15 | DS3234.14 50.8,40.64 | DS3234.13 50.8,39.37 | DS3234.12 50.8,38.1 | 36.83,38.1 36.83,36.83 | 50.8,38.1 50.8,36.83 | BAT1.GND v53.34,13.97 | C33.1 C32.1 18.55,4.32 v16.83,6.03 | ADS1256.3 77.85,39.12 80.01,41.27 80.01,44.32 C5.2 C4.2 C3.2 81.41,50.8 90.81,50.8 92.58,49.02 C16.2 92.69,46.88 ADR3425.1 90.47,43.48 89.53,42.55 89.53,38.1 90.17,37.47 C17.2 C35.2 90.17,34.92 v88.9,33.66 | 72.34,12.25 72.34,13.6 v72.39,13.65 | 50.8,36.83 v50.8,28.89 | 36.83,36.83 v34.92,36.83 34.92,34.92 34.29,34.29 34.29,33.22 LED1.C | 10.34,8.85 RESET.A2 | v35.56,24.77 34.61,25.72 34.61,31.43 34.29,31.75 34.29,33.02 v32.07,33.02 | v10.48,10.79 10.48,9.02 RESET.A2
  Top 0.406: RESET.A2 10.32,6.18 v11.43,5.08
  Top 0.61: ADUM5000.14 27.3,42.04 C22.2 C23.2 27.18,36.38 26.35,35.56 v25.4,35.56 | ADUM5000.9 20.95,42.04 C24.2 C25.2 20.82,36.33 21.59,35.56 v22.23,35.56
  pour Bottom (isolate 0.406, no thermals): 96.24,1.59 3.77,1.59 arc-90 1.27,4.09 1.27,48.3 arc-90 3.77,50.8 96.24,50.8 arc-90 98.74,48.3 98.74,4.09 arc-90
  pour Top (no thermals): 27.3,48.26 28.57,48.26 28.57,44.45 27.3,43.18
  pour Top (no thermals): 20.95,48.26 20.95,43.81 19.37,43.81 18.73,44.45 18.73,48.26
GND_SENSE  (via drill 0.6)
  Top 0.406: ADR3425.2 91.44,42.55 90.81,41.91 v90.81,40.64
  Bottom 0.406: v79.38,40.64 v90.81,40.64
IN1
  Top 0.406: MAX14850.2 14.61,56.52 17.14,59.05 17.14,66.04 21.59,70.48 21.59,74.3 ISOLATED_CON.3
IN2
  Top 0.406: MAX14850.3 13.34,57.15 15.88,59.69 15.88,66.67 20.32,71.12 ISOLATED_CON.4
IN2_ISO  (via drill 0.6)
  Top 0.406: MAX14850.14 13.34,47.62 16.51,44.45 v16.51,41.27 | ATMEGA328.9 28.16,15.88 v26.04,15.88 | v16.51,28.57 5.71,28.57 NON-ISOLATED_CON.4
  Bottom 0.406: v16.51,41.27 v16.51,28.57 16.51,18.41 19.05,15.88 v26.04,15.88
MISO  (via drill 0.6)
  Top 0.406: DS3234.19 50.16,46.99 53.98,43.18 v53.98,31.75 53.98,24.13 45.72,15.88 v37.47,15.88 34.07,15.88 ATMEGA328.16 | ADS1256.22 75.26,30.15 73.66,31.75 v63.5,31.75 | v19.68,24.13 17.14,24.13 14.61,21.59 14.61,18.41 10.79,14.61 6.35,14.61 4.45,16.51 ICSP.1
  Bottom 0.406: v63.5,31.75 v53.98,31.75 | v19.68,24.13 33.02,24.13 37.47,19.68 v37.47,15.88
MOSI  (via drill 0.6)
  Top 0.406: ATMEGA328.15 33.12,15.14 33.66,14.61 v45.72,14.61 46.99,14.61 52.07,19.68 53.34,19.68 53.34,20.19 | DS3234.17 50.8,44.45 53.02,42.23 53.02,26.99 v52.07,26.04 | 53.34,20.32 53.34,20.19 | 53.34,20.19 R7.2 53.98,19.82 53.98,20.95 55.88,22.86 v55.88,26.04
  Bottom 0.406: v52.07,26.04 v55.88,26.04 | v45.72,14.61 40.01,8.89 8.26,8.89 2.54,14.61 2.54,20.32 3.81,21.59 5.08,21.59 ICSP.4
N$1  (via drill 0.6)
  Top 0.406: v65.41,33.02 73.66,33.02 76.56,30.12 ADS1256.24 | R6.1 v44.45,33.02
  Bottom 0.406: v44.45,33.02 v65.41,33.02
N$2
  Top 0.61: R2A40.2 JP1A.3
N$3
  Top 0.61: R2A400.2 JP1A.1
N$4
  Top 0.61: JP2A.3 R2A400.1
N$5
  Top 0.61: JP2A.1 R2A40.1
N$6
  Top 0.406: ATMEGA328.8 25.77,17.52 24.77,16.51 24.77,10.92 Q2.2 24.64,9.4 24.13,8.89 C33.2
N$7
  Top 0.61: R2B40.2 JP1B.3
N$8
  Top 0.61: R2B400.2 JP1B.1
N$9
  Top 0.61: JP2B.3 R2B400.1
N$10
  Top 0.61: JP2B.1 R2B40.1
N$11
  Top 0.406: C8.1 74.8,15.18 Q1.1 73.3,20.55 ADS1256.19
N$12
  Top 0.406: C9.1 69.98,15.18 Q1.2 72.64,21.72 ADS1256.18
N$13
  Top 0.406: ATMEGA328.7 24.04,18.32 19.68,13.97 19.68,10.92 Q2.1 19.81,9.4 20.32,8.89 C32.2
N$14  (via drill 0.6)
  Top 0.406: v75.56,22.86 75.89,23.19 ADS1256.23 | v71.12,22.86 70.48,22.86 67.31,19.68 R7.1
  Bottom 0.406: v71.12,22.86 v75.56,22.86
N$15  (via drill 0.6)
  Top 0.406: 45.72,7.62 45.72,9.53 v51.44,15.24 56.52,15.24 60.96,10.79 60.96,6.6 BAT1.PWR@1 | DS3234.16 50.16,43.18 52.07,41.27 52.07,28.57 48.9,25.4 v48.9,20.95
  Bottom 0.406: v48.9,20.95 48.9,17.78 v51.44,15.24
N$16
  Top 0.406: ADS1256.20 73.97,21.92 77.47,18.41 77.47,12.06 75.56,10.16 66.67,10.16 59.69,17.14 51.44,17.14 46.99,12.7 R8.1
N$17
  Top 0.406: ADS1256.15 70.54,27.94 63.5,27.94 62.36,29.08 RST.2
N$18
  Top 0.406: ATMEGA328.24 36.45,23.12 37.47,24.13 37.47,26.04 36.2,27.3 36.2,29.21 38.1,31.11 40.64,31.11 41.27,31.75 41.27,32.83 R12.1
N$19
  Top 0.406: R12.2 36.61,33 LED1.A
N$20
  Top 0.406: ADS1256.14 62.05,35.38 61.59,34.92 60.45,34.92 SYNC.2
N$21
  Top 0.406: LP2985.4 90.19,19.02 88.27,20.95 C29.1
N$24
  Top 0.406: 2.54,8.89 10.16,8.89
N$25
  Top 0.406: 2.22,13.34 10.48,13.34
OUT1
  Top 0.406: MAX14850.4 12.06,58.42 14.61,60.96 14.61,67.31 19.05,71.75 19.05,74.3 ISOLATED_CON.5
OUT1_ISO  (via drill 0.6)
  Top 0.406: MAX14850.13 12.06,46.35 v15.24,43.18 | ATMEGA328.10 29.11,14.51 v28.57,13.97 | NON-ISOLATED_CON.5 v15.24,29.84
  Bottom 0.406: v15.24,43.18 v15.24,29.84 15.24,17.78 19.05,13.97 v28.57,13.97
OUT2
  Top 0.406: MAX14850.5 10.79,59.05 13.34,61.59 13.34,67.94 17.78,72.39 ISOLATED_CON.6
OUT2_ISO  (via drill 0.6)
  Top 0.406: MAX14850.12 10.79,45.09 v13.97,41.91 | ATMEGA328.14 32.31,14.68 33.66,13.34 v34.92,13.34
  Bottom 0.406: v13.97,41.91 13.97,31.11 | 13.97,31.11 13.97,17.14 18.41,12.7 34.29,12.7 v34.92,13.34 | 13.97,31.11 5.71,31.11 NON-ISOLATED_CON.6
RESET  (via drill 0.6, 1.1 pad 1.78)
  Top 0.406: MAX14850.15 14.61,48.26 17.78,45.09 17.78,34.92 v19.68,33.02 | R11.2 17.02,18.29 v13.97,15.24 12.09,13.36 | ATMEGA328.29 30.71,26.27 31.75,27.3 31.75,29.21 31.11,29.84 27.3,29.84 24.77,27.3 v24.13,27.3 v12.7,27.3 NON-ISOLATED_CON.3 | RESET.B2 12.09,13.36 | 12.09,13.36 12.09,13.31 13.97,11.43 v13.97,5.08
  Bottom 0.406: v24.13,27.3 24.13,28.57 v19.68,33.02 | v13.97,15.24 12.7,16.51 12.7,17.14 | v12.7,27.3 12.7,17.14 | ICSP.5 12.7,17.14
RTC_CS  (via drill 0.6)
  Top 0.406: DS3234.1 40.64,48.26 45.09,43.81 45.09,36.2 46.35,34.92 v46.35,24.77 | ATMEGA328.12 30.71,14.37 33.02,12.06 36.2,12.06 v37.47,13.34
  Bottom 0.406: v37.47,13.34 40.01,13.34 46.35,19.68 v46.35,24.77
RTC_SQW  (via drill 0.6)
  Top 0.406: v27.94,33.02 30.48,33.02 33.66,36.2 R9.1 33.84,39.69 34.92,39.69 35.56,40.32 35.56,41.91 36.83,43.18 DS3234.5 | v26.67,27.3 26.82,27.15 ATMEGA328.1
  Bottom 0.406: v27.94,33.02 26.67,31.75 v26.67,27.3
RX  (via drill 0.6)
  Top 0.406: ATMEGA328.30 29.91,26.74 30.48,27.3 v30.48,28.57
  Bottom 0.406: v30.48,28.57 36.67,28.57 RX-TX.1
SCL
  Top 0.406: 8.26,68.58 8.26,69.22 12.06,73.03 ISOLATED_CON.8 | 8.26,68.58 MAX14850.7 | R2.1 8.12,68.71 8.26,68.58
SCL_ISO
  Top 0.406: MAX14850.10 8.26,35.88 | 6.99,35.56 6.48,35.56 R5.1 | 8.26,35.88 13.65,35.88 18.73,30.8 31.75,30.8 32.7,29.84 32.7,26.99 31.52,25.8 ATMEGA328.28 | 8.26,35.88 6.54,35.88 R5.1 | NON-ISOLATED_CON.8 4.45,35.24 5.08,35.88 6.16,35.88 R5.1
SCLK  (via drill 0.6)
  Top 0.406: DS3234.20 46.99,48.26 46.35,47.62 46.35,45.72 | DS3234.18 46.35,45.72 | v19.68,26.04 17.78,26.04 13.34,21.59 13.34,18.41 10.16,15.24 8.89,15.24 ICSP.3 | 44.45,17.52 R6.2 | 46.35,45.72 46.35,36.2 47.62,34.92 v47.62,26.04 47.62,19.05 46.23,17.65 R6.2 | 44.32,17.52 R6.2 | ATMEGA328.17 38.36,17.52 38.73,17.14 42.55,17.14 42.86,17.46 44.26,17.46 R6.2
  Bottom 0.406: v19.68,26.04 v47.62,26.04
SDA
  Top 0.406: MAX14850.6 9.53,59.69 12.06,62.23 12.06,67.31 | ISOLATED_CON.7 16.51,74.3 16.51,72.39 12.06,67.94 12.06,67.31 | R3.1 11.94,67.44 12.06,67.31
SDA_ISO  (via drill 0.6)
  Top 0.406: MAX14850.11 9.53,45.09 12.7,41.91 12.7,37.47 | 12.7,37.47 13.34,37.47 19.05,31.75 v25.4,31.75 32.38,31.75 33.66,30.48 33.66,26.99 32.31,25.65 ATMEGA328.27 | 12.7,37.47 10.66,37.47 R4.1 | v25.08,29.53 18.73,29.53 15.88,32.38 NON-ISOLATED_CON.7
  Bottom 0.406: v25.4,31.75 25.4,29.84 v25.08,29.53
TX  (via drill 0.6)
  Top 0.406: ATMEGA328.31 29.11,27.53 v29.21,27.62
  Bottom 0.406: RX-TX.2 39.84,27.3 29.53,27.3 v29.21,27.62
VBUS1  (via drill 0.6)
  Top 0.61: JP1A.2 40.32,75.56 43.18,78.42 v51.44,78.42 JP1B.2
  Bottom 0.61: VOUT.P$1 69.88,78.42 v51.44,78.42
  other vias: 78.11,65.09 78.11,76.52 84.14,69.22 80.33,73.03 75.56,73.03 71.75,69.22 75.56,69.22 71.75,73.03 84.14,73.03 80.33,69.22
  pour Top (no thermals): 71.12,78.74 85.72,78.74 87,77.47 87,66.04 85.09,64.14 71.75,64.14 69.85,66.04 69.85,77.47
  pour Bottom (no thermals): 69.85,77.47 71.12,78.74 85.72,78.74 87,77.47 87,66.04 85.09,64.14 71.75,64.14 69.85,66.04
VBUS2  (via drill 0.6)
  other vias: 97.79,62.55 97.16,75.56 93.34,71.12 97.16,71.12 97.16,66.67 93.98,62.55 93.98,59.69 93.98,56.83 90.49,62.55
  pour Top (no thermals): 99.06,76.83 99.06,55.24 88.9,55.24 87.63,57.15 87.63,61.59 91.44,65.41 91.44,77.47 92.71,78.74 97.16,78.74
  pour Bottom (no thermals): 91.44,77.47 92.71,78.74 97.16,78.74 99.06,76.83 99.06,55.24 88.9,55.24 87.63,57.15 87.63,61.59 91.44,65.41
VREF_2V5
  Top 0.406: ADS1256.4 77.22,42.55 | 77.22,42.55 77.22,44.33 C5.1 C4.1 C3.1 77.47,49.66 77.47,50.8 78.74,52.07 92.08,52.07 95.38,48.77 C16.1 95.28,46.88 ADR3425.6 | 77.22,42.55 76.2,42.55 74.93,43.81 74.93,50.8 77.47,53.34 93.34,53.34 97.16,49.53 97.16,43.18 96.52,42.55 95.25,42.55

### Text on the board
Top: KULEUVEN - IMEC | TOP
Bottom: VPANEL Input | Nominal: 40V@8A / Max: 44V@15A | BOTTOM
tSilk: - | + | + | - | * | SHUNT | AIN6 | AIN7 | RX | TX | * | * | RESET | BATTERY / RTC 3V | 3V3 | 5V | 1W | GND | GND | RST | PV Measurements | v2.7 - April 2016 / Paschalis Sideridis | 5V